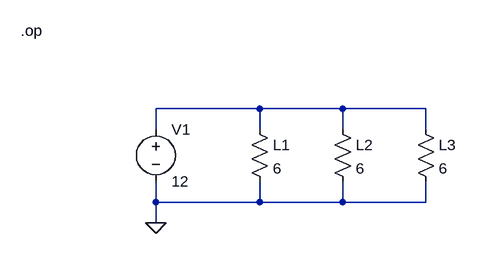
[diagram p0: schematic circuit.asc]
circuit.asc, the LTspice schematic file:
Version 4.1
SHEET 1 880 680
WIRE 160 80 0 80
WIRE 288 80 160 80
WIRE 416 80 288 80
WIRE 0 112 0 80
WIRE 160 112 160 80
WIRE 288 112 288 80
WIRE 416 112 416 80
WIRE 0 224 0 192
WIRE 160 224 160 192
WIRE 160 224 0 224
WIRE 288 224 288 192
WIRE 288 224 160 224
WIRE 416 224 416 192
WIRE 416 224 288 224
WIRE 0 256 0 224
FLAG 0 256 0
DATAFLAG 160 80 ""
DATAFLAG 288 80 ""
DATAFLAG 416 80 ""
DATAFLAG 160 224 ""
DATAFLAG 288 224 ""
DATAFLAG 416 224 ""
DATAFLAG 48 80 "-I(V1)"
DATAFLAG 256 128 "I(R2)"
DATAFLAG 384 128 "I(R3)"
DATAFLAG 128 128 "I(R1)"
DATAFLAG 208 80 "4A"
DATAFLAG 336 80 "2A"
SYMBOL voltage 0 96 R0
WINDOW 123 0 0 Left 0
WINDOW 39 0 0 Left 0
SYMATTR InstName V1
SYMATTR Value 12
SYMBOL res 144 96 R0
SYMATTR InstName L1
SYMATTR Value 6
SYMBOL res 272 96 R0
SYMATTR InstName L2
SYMATTR Value 6
SYMBOL res 400 96 R0
SYMATTR InstName L3
SYMATTR Value 6
TEXT -208 -40 Left 2 !.op

The netlist it stands for:
* circuit.asc
V1 N001 0 12
R§L1 N001 0 6
R§L2 N001 0 6
R§L3 N001 0 6
.op
.backanno
.end